# Altium schematic sheet 15.SchDoc: Наименование
size 209 x 297 mm; ApprovedBy: Утвердил; CheckedBy: Проверил; Author: Разработал; CompanyName: Организация; DrawnBy: Н.Контр; Engineer: Т.Контр; SheetNumber: 1; SheetTotal: 1; PageSetup: Record=PageOptions|CenterHorizontal=True|CenterVertical=True|PrintScale=0.94|XCorrection=1.00|YCorrection=1.00|PrintKind=1|BorderSize=5000000|LeftOffset=0|BottomOffset=0|Orientation=1|PaperLength=1000|PaperWidth=1000|Scale=100|PaperSource=7|PrintQuality=-4|MediaType=1|DitherType=10|PaperKind=A4|PrintScaleMode=1; DecimalNumber: Децимальный номер; HeadOfSector: Нач. сектора; MainDevice: Перв.примен.; Name: Наименование; DocumentName: Sheet1.SCHDOC
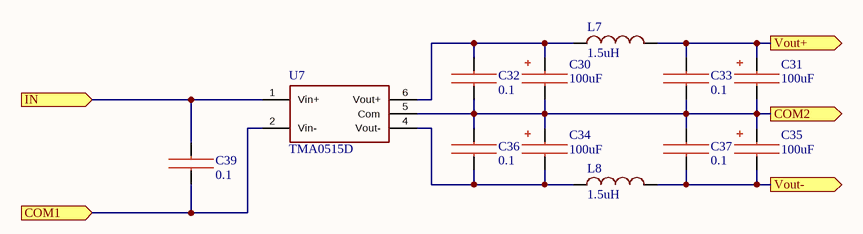
[diagram p0: 15.SchDoc]

## Parts
C30  100uF  [TANTAL TYPE D]
C31  100uF  [TANTAL TYPE D]
C32  0.1  [CC0805_3D]
C33  0.1  [CC0805_3D]
C34  100uF  [TANTAL TYPE D]
C35  100uF  [TANTAL TYPE D]
C36  0.1  [CC0805_3D]
C37  0.1  [CC0805_3D]
C39  0.1  [CC0805_3D]
L7  1.5uH  [SDR0805]
L8  1.5uH  [SDR0805]
U7  TMA0515D  [Dual]

## Ports
COM1 (in), COM2 (out), IN (in), Vout+ (out), Vout- (out)

## Nets
COM1: C39.1 U7.2(Vin-) ; port COM1
COM2: C30.1 C31.1 C32.1 C33.1 C34.2 C35.2 C36.2 C37.2 U7.5(Com) ; port COM2
IN: C39.2 U7.1(Vin+) ; port IN
Vout+: C31.2 C33.2 L7.2 ; port Vout+
Vout-: C35.1 C37.1 L8.2 ; port Vout-
NetC30_2: C30.2 C32.2 L7.1 U7.6(Vout+)
NetC34_1: C34.1 C36.1 L8.1 U7.4(Vout-)

## Notes on the sheet
- Подп. и дата
- Инв.№ дубл.
- Взам.инв.№
- Подп.и дата
- Инв.№ подл.
- Изм.
- Лист
- № докум.
- Подп.
- Дата
- Формат  A4

## Library data of the parts
C30 C31 C34 C35 = Tantal D 100uF: Value: 100uF
C32 C33 C36 C37 C39 = CC0805 X uF: Value: 0.1
L7 L8 = SDR0805: value: 2.5uH; value: 3.3uH; value: 3.9uH; value: 4.7uH; value: 5.6uH; value: 6.8uH; value: 7.5uH; value: 8.2uH; value: 10uH; value: 12uH; value: 15uH; value: 18uH; value: 22uH; value: 27uH; value: 33uH; value: 39uH; value: 47uH; value: 56uH; value: 68uH; value: 82uH; value: 100uH; value: 120uH; value: 150uH; value: 180uH; value: 220uH; value: 270uH; value: 330uH; value: 390uH; value: 470uH; value: 560uH; value: 680uH; value: 820uH; value: 1000uH; value: 1200uH; value: 1500uH; value: 1800uH; value: 2200uH; value: 2700uH; value: 3300uH; value: 3900uH; value: 4700uH; value: 1.5uH
U7 = TMA0515D: 5V to +/-15V TMA Series, 1 Watt